# Altium schematic sheet Capteurs_et_Antenne.SchDoc: CAPTEURS ET ANTENNE BLUETOOTH
size A4; CheckedBy: P. FISCHER; Author: Y. NAIT et P. FISCHER; CompanyName: LE GROUPE DE 5; DrawnBy: Y. NAIT et P. FISCHER; DocumentNumber: SCH_CARTE_MONITORING_PERMANENT_0; Revision: A.0; SheetNumber: 3; SheetTotal: 7
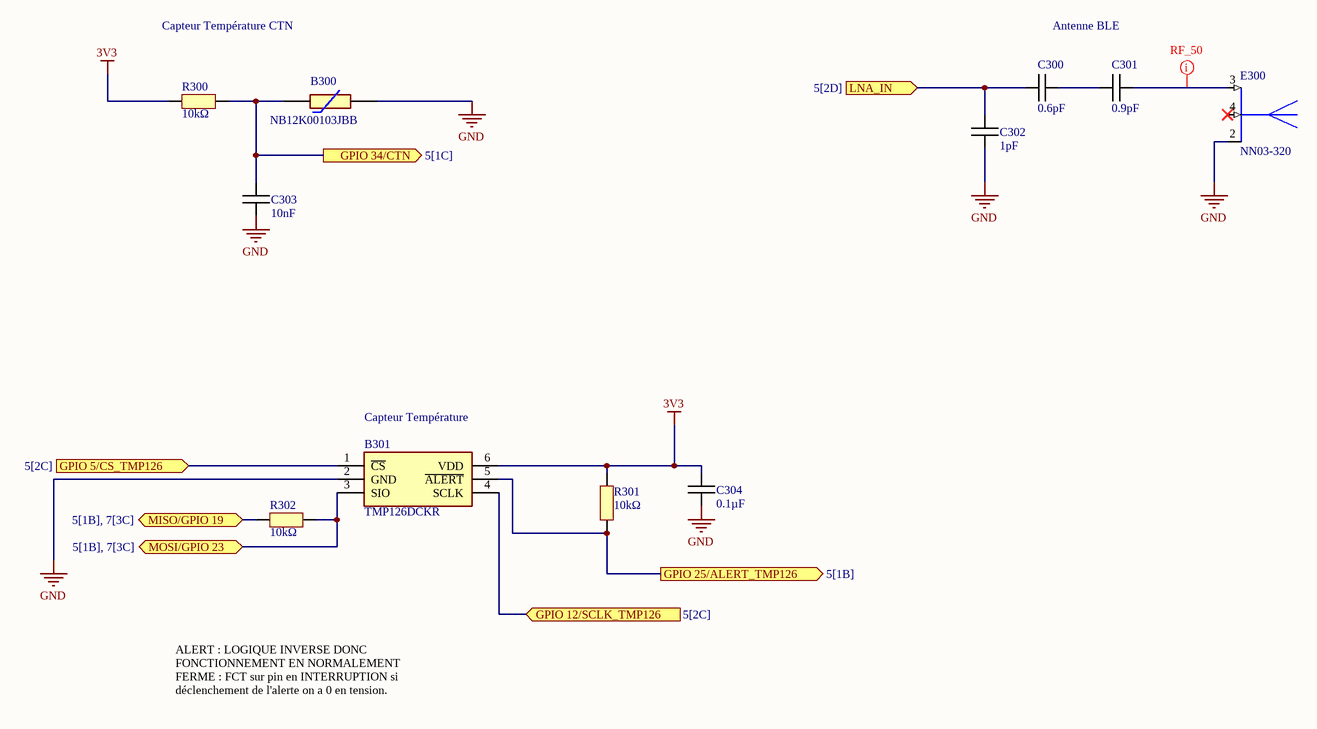
[diagram p0: Capteurs_et_Antenne.SchDoc]

## Parts
B300  NB12K00103JBB  [RESC2212X50N]
B301  TMP126DCKR  [SOT65P210X110-6N]
C300  0.6pF  [CAPC1005X06N]
C301  0.9pF  [CAPC1005X06N]
C302  1pF  [CAPC1005X06N]
C303  10nF  [CAPC1005X06N]
C304  0.1µF  [CAPC1005X06N]
E300  NN03-320  [XCVR_NN03-320]
R300  10kΩ  [RESC1005X06N]
R301  10kΩ  [RESC1005X06N]
R302  10kΩ  [RESC1005X06N]

## Ports
GPIO 5/CS_TMP126 (in, see 5[2C]), GPIO 12/SCLK_TMP126 (in, see 5[2C]), GPIO 25/ALERT_TMP126 (out, see 5[1B]), GPIO 34/CTN (out, see 5[1C]), LNA_IN (in, see 5[2D]), MISO/GPIO 19 (bidir, see 5[1B], 7[3C]), MOSI/GPIO 23 (bidir, see 5[1B], 7[3C])

## Nets
3V3: B301.6(VDD) C304.1 R300.1 R301.2
GND: B300.2 B301.2(GND) C302.1 C303.2 C304.2 E300.2(GROUND)
GPIO 5/CS_TMP126: B301.1(~{CS}) ; port GPIO 5/CS_TMP126
GPIO 12/SCLK_TMP126: B301.4(SCLK) ; port GPIO 12/SCLK_TMP126
GPIO 25/ALERT_TMP126: B301.5(~{ALERT}) R301.1 ; port GPIO 25/ALERT_TMP126
GPIO 34/CTN: B300.1 C303.1 R300.2 ; port GPIO 34/CTN
LNA_IN: C300.2 C302.2 ; port LNA_IN
MISO/GPIO 19: R302.1 ; port MISO/GPIO 19
MOSI/GPIO 23: B301.3(SIO) R302.2 ; port MOSI/GPIO 23
NetC300_1: C300.1 C301.1
NetC301_2: C301.2 E300.3(FEED_BLUETOOTH)

Not connected (* = marked no-connect by the designer): E300 4(FEED_GNSS)*

## Layout directives
rule Width Constraint [Pref Impedance = 50.00ohms    Min Impedance = 50.00ohms    Max Impedance = 50.00ohms]: NetC301_2

## Notes on the sheet
- Capteur Température CTN
- Antenne BLE
- (near B301) Capteur Température
- ALERT : LOGIQUE INVERSE DONC FONCTIONNEMENT EN NORMALEMENT FERME : FCT sur pin en INTERRUPTION si déclenchement de l'alerte on a 0 en tension.

## Library data of the parts
B300 = NB12K00103JBB: CTN Capteur - NTC SMD Thermistor, NB12K, 10K, 5% AVX 10k 0805 Protection NTC Thermistor, 5s, 2 x 1.25 x 1.3mm; Manufacturer_Name: Kyocera AVX; Geometry.Height: 0.5mm; Manufacturer_Part_Number: NB12K00103JBB; Mouser Part Number: 581-NB12K00103JBB; Mouser Price/Stock: https://www.mouser.co.uk/ProductDetail/AVX/NB12K00103JBB/?qs=4%252B6%252BTdINQeDPvI%252BQUQjJ3Q%3D%3D; Arrow Part Number: NB12K00103JBB; Arrow Price/Stock: https://www.arrow.com/en/products/nb12k00103jbb/avx; Datasheet Link: https://datasheet.datasheetarchive.com/originals/distributors/Datasheets-DGA6/551314.pdf
B301 = TMP126DCKR: Board Mount Temperature Sensors +/-0.25 C SPI temperature sensor with 175 C operation, CRC and slew-rate alert; Manufacturer_Name: Texas Instruments; Manufacturer_Part_Number: TMP126DCKR; Mouser Part Number: 595-TMP126DCKR
C300-C304 = Capacitor
E300 = NN03-320: Dual port antenna booster for GNSS, Bluetooth, 5G and UWB (1561 - 1606MHz, 2400 - 2500MHz, 3400 - 3800MHz, 3100 - 4800MHz and 6000 - 10600 MHz), signal booster; Manufacturer_Name: Ignion; Manufacturer_Part_Number: NN03-320; Mouser Part Number: 128-NN03-320
R300-R302 = Resistor